# EAGLE design XBEE (EAGLE 6.4)
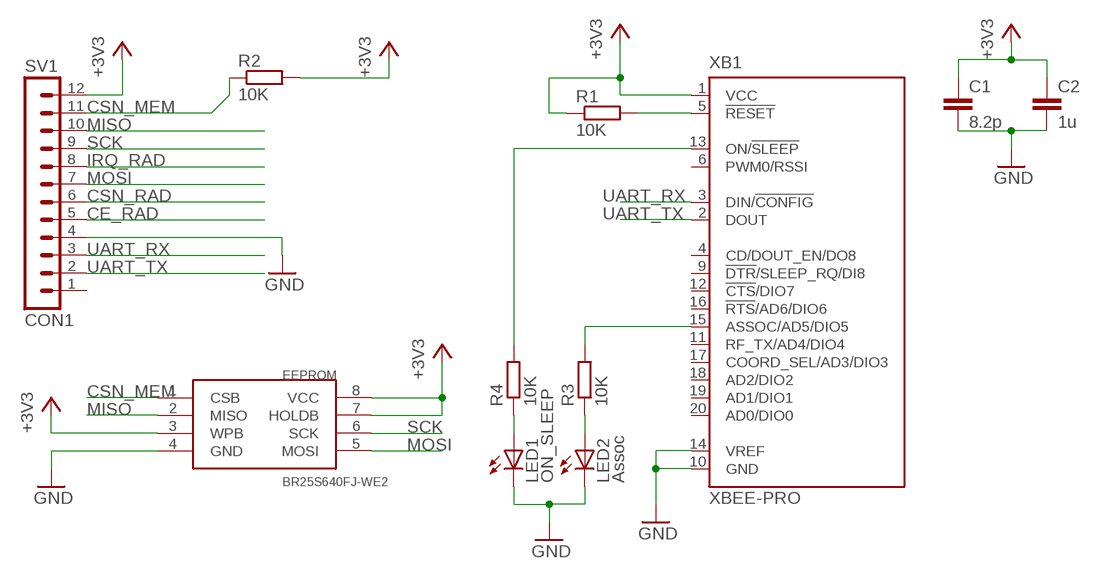
[diagram p0: schematic, sheet 1]

## Parts
C1  8.2p  C-EUC1206  [C1206]
C2  1u  C-EUC1206  [C1206]
EEPROM  BR25S640FJ-WE2  [SO8]
LED1  ON_SLEEP  LEDSMT1206  [1206]
LED2  Assoc  LEDSMT1206  [1206]
R1  10K  R-EU_R1206  [R1206]
R2  10K  R-EU_R1206  [R1206]
R3  10K  R-EU_R1206  [R1206]
R4  10K  R-EU_R1206  [R1206]
SV1  CON1  MA12-1W  [MA12-1W]
XB1  XBEE-PRO  [XBEE-PRO]

## Nets
+3V3: C1.1 C2.1 EEPROM.3(WPB) EEPROM.7(HOLDB) EEPROM.8(VCC) R1.1 R2.2 SV1.12 XB1.1(VCC)
CE_RAD: SV1.5
CSN_MEM: EEPROM.1(CSB) R2.1 SV1.11
CSN_RAD: SV1.6
GND: C1.2 C2.2 EEPROM.4(GND) LED1.C LED2.C SV1.4 XB1.10(GND) XB1.14(VREF)
IRQ_RAD: SV1.8
MISO: EEPROM.2(MISO) SV1.10
MOSI: EEPROM.5(MOSI) SV1.7
N$1: R1.2 XB1.5(!RESET)
N$3: R4.2 XB1.13(ON/!SLEEP)
N$5: R3.2 XB1.15(ASSOC/AD5/DIO5)
N$6: LED1.A R4.1
N$7: LED2.A R3.1
SCK: EEPROM.6(SCK) SV1.9
UART_RX: SV1.3 XB1.3(DIN/!CONFIG)
UART_TX: SV1.2 XB1.2(DOUT)
Unconnected: SV1.1 XB1.4(CD/DOUT_EN/DO8) XB1.6(PWM0/RSSI) XB1.9(!DTR!/SLEEP_RQ/DI8) XB1.11(RF_TX/AD4/DIO4) XB1.12(!CTS!/DIO7) XB1.16(!RTS!/AD6/DIO6) XB1.17(COORD_SEL/AD3/DIO3) XB1.18(AD2/DIO2) XB1.19(AD1/DIO1) XB1.20(AD0/DIO0)

## Library data of the parts
C1 C2 = rcl:C-EU: CAPACITOR, European symbol
EEPROM = eeprom:BR25S640FJ-WE2
LED1 LED2 = led:LED: LED OSRAM: - CHIPLED LG R971, LG N971, LY N971, LG Q971, LY Q971, LO R971, LY R971 LH N974, LH R974 LS Q976, LO Q976, LY Q976 LO Q996 - Hyper CHIPLED LW Q18S LB Q993, LB Q99A, LB R99A - SideLED LS A670, LO A670, LY A670, LG A670, LP A670 LB A673, LV A673, LT A673, LW A673 LH A674 LY A675 LS A676, LA A676, LO A676, LY A676, LW A676 LS A679, LY A679, LG A679 - Hyper Micro SIDELED® LS Y876, LA Y876, LO Y876, LY Y876 LT Y87S - SmartLED LW L88C, LW L88S LB L89C, LB L89S, LG L890 LS L89K, LO L89K, LY L89K LS L896, LA L896, LO L896, LY L896 - TOPLED LS T670, LO T670, LY T670, LG T670, LP T670 LSG T670, LSP T670, LSY T670, LOP T670, LYG T670 LG T671, LOG T671, LSG T671 LB T673, LV T673, LT T673, LW T673 LH T674 LS T676, LA T676, LO T676, LY T676, LB T676, LH T676, LSB T676, LW T676 LB T67C, LV T67C, LT T67C, LS T67K, LO T67K, LY T67K, LW E67C LS E67B, LA E67B, LO E67B, LY E67B, LB E67C, LV E67C, LT E67C LW T67C LS T679, LY T679, LG T679 LS T770, LO T770, LY T770, LG T770, LP T770 LB T773, LV T773, LT T773, LW T773 LH T774 LS E675, LA E675, LY E675, LS T675 LS T776, LA T776, LO T776, LY T776, LB T776 LHGB T686 LT T68C, LB T68C - Hyper Mini TOPLED® LB M676 - Mini TOPLED Santana® LG M470 LS M47K, LO M47K, LY M47K Source: http://www.osram.convergy.de LUXEON: - LUMILED® LXK2-PW12-R00, LXK2-PW12-S00, LXK2-PW14-U00, LXK2-PW14-V00 LXK2-PM12-R00, LXK2-PM12-S00, LXK2-PM14-U00 LXK2-PE12-Q00, LXK2-PE12-R00, LXK2-PE12-S00, LXK2-PE14-T00, LXK2-PE14-U00 LXK2-PB12-K00, LXK2-PB12-L00, LXK2-PB12-M00, LXK2-PB14-N00, LXK2-PB14-P00, LXK2-PB14-Q00 LXK2-PR12-L00, LXK2-PR12-M00, LXK2-PR14-Q00, LXK2-PR14-R00 LXK2-PD12-Q00, LXK2-PD12-R00, LXK2-PD12-S00 LXK2-PH12-R00, LXK2-PH12-S00 LXK2-PL12-P00, LXK2-PL12-Q00, LXK2-PL12-R00 Source: www.luxeon.com KINGBRIGHT: KA-3528ASYC Source: www.kingbright.com
R1-R4 = resistor:R-EU_: RESISTOR, European symbol
SV1 = con-lstb:MA12-1W: PIN HEADER; OC_FARNELL: unknown; OC_NEWARK: unknown
XB1 = maxstream:XBEE: XBee (TM) /XBee-PRO(TM) OEM RF Modules Source: MaxStream, Inc. xbee_productmanual.pdf; MPN: XBP24-AWI-001; OC_FARNELL: 1337916; OC_NEWARK: 42M2667

## Board
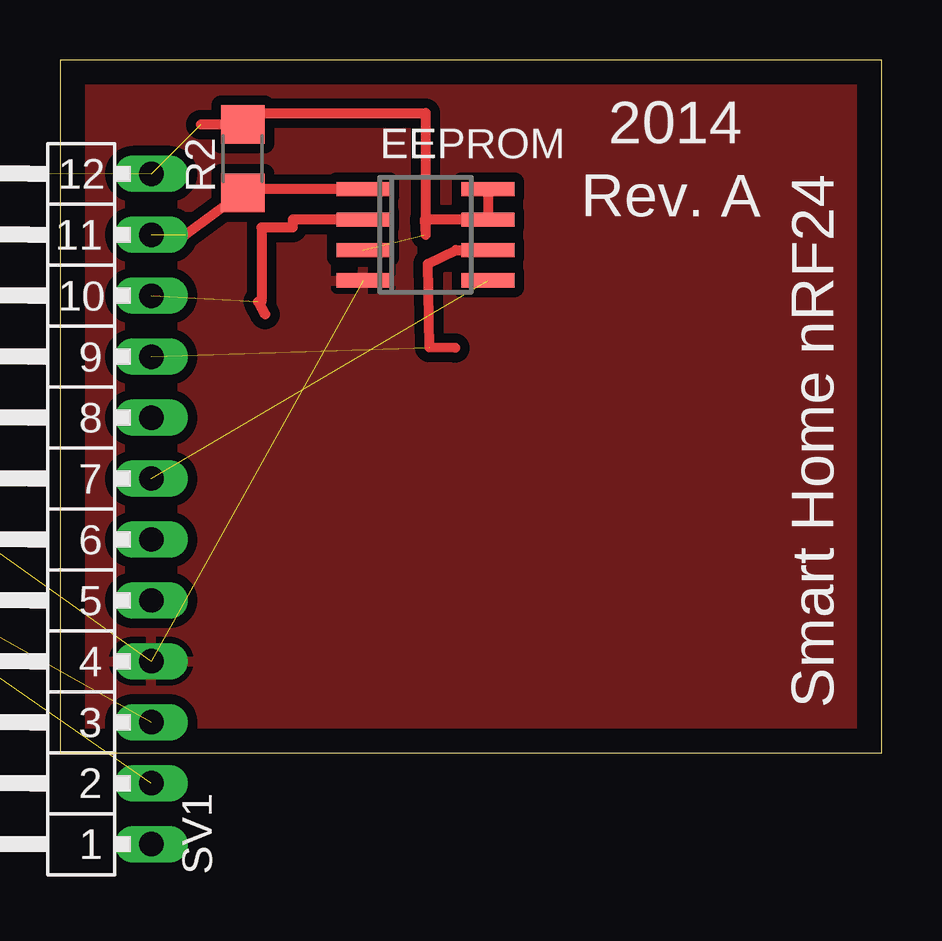
[diagram p1: board, top side]

Size 34.27 x 28.88 mm. Coordinates in mm from the lower left corner, seen from the top.
Outline: 0,0 34.27,0 34.27,28.88 0,28.88 0,0
Copper layers (1*16): Top 0.035mm / dielectric 1.5mm / Bottom 0.035mm
Design rules "default": minimum track width 10mil, minimum drill 24mil, track to track 8mil, track to pad 8mil, pad to pad 8mil, via to via 8mil, smd to smd 8mil, copper to edge 40mil, drill to drill 8mil, minimum pad ring 10mil, minimum via ring 8mil, stop-mask expansion 4mil, vias tented up to drill 0mil, thermal gap 10mil

### Footprints (pad centres in the part's own frame; a part is rotated, then mirrored left to right if it is on the bottom)
C1206 = smd 1.6 x 1.8: 1 -1.4,0; 2 1.4,0
SO8 = smd 0.6 x 2.2: 1 -1.905,-2.6; 2 -0.635,-2.6; 3 0.635,-2.6; 4 1.905,-2.6; 5 1.905,2.6; 6 0.635,2.6; 7 -0.635,2.6; 8 -1.905,2.6
1206 = smd 1.6 x 1.803: A -1.422,0; C 1.422,0
R1206 = smd 1.6 x 1.803: 1 -1.422,0; 2 1.422,0
MA12-1W = drill 1.016 long: 1 -13.97,0; 2 -11.43,0; 3 -8.89,0; 4 -6.35,0; 5 -3.81,0; 6 -1.27,0; 7 1.27,0; 8 3.81,0; 9 6.35,0; 10 8.89,0; 11 11.43,0; 12 13.97,0
XBEE-PRO = drill 0.8 pad 1.27: 1 -11,9; 2 -11,7; 3 -11,5; 4 -11,3; 5 -11,1; 6 -11,-1; 7 -11,-3; 8 -11,-5; 9 -11,-7; 10 -11,-9; 11 11,-9; 12 11,-7; 13 11,-5; 14 11,-3; 15 11,-1; 16 11,1; 17 11,3; 18 11,5; 19 11,7; 20 11,9

### Placement (x,y rotation side)
C1  -27.94,-39.37 0 top  (outside the outline)
C2  -27.94,-44.45 0 top  (outside the outline)
EEPROM  15.24,21.59 270 top
LED1  -27.94,-27.94 0 top  (outside the outline)
LED2  -27.94,-33.02 0 top  (outside the outline)
R1  -27.94,-8.89 0 top  (outside the outline)
R2  7.62,24.77 90 top
R3  -27.94,-15.24 0 top  (outside the outline)
R4  -27.94,-21.59 0 top  (outside the outline)
SV1  3.81,10.16 90 top
XB1  -19.05,15.24 0 top  (outside the outline)

### Tracks (layer width: path | path; a pad name or v marks a point on that pad's centre or on a via)
+3V3  (6 unrouted)
  Top 0.406: EEPROM.8 EEPROM.7 15.21,22.23 15.24,21.59 15.24,26.67 8.1,26.67 R2.2 5.87,26.19
CSN_MEM  (1 unrouted)
  Top 0.406: EEPROM.1 8.41,23.5 R2.1 5.23,21.59
GND  (7 unrouted)
  pour Top (isolate 0.406): 0,27.94 0,-1.27 34.29,-1.27 34.29,27.94
MISO  (1 unrouted)
  Top 0.406: EEPROM.2 9.7,22.23 9.7,21.9 8.4,21.9 8.4,18.8 8.26,18.8 8.55,18.27
MOSI  (1 unrouted)
N$1  (1 unrouted)
N$3  (1 unrouted)
N$5  (1 unrouted)
N$6  (1 unrouted)
N$7  (1 unrouted)
SCK  (1 unrouted)
  Top 0.406: 16.47,16.88 15.4,16.9 15.34,20.39 16.51,20.95 EEPROM.6
UART_RX  (1 unrouted)
UART_TX  (1 unrouted)

### Text on the board
tPlace: 2014 | Rev. A | Smart Home nRF24